# Altium schematic sheet [6]H-bridge2.SchDoc
size Tabloid
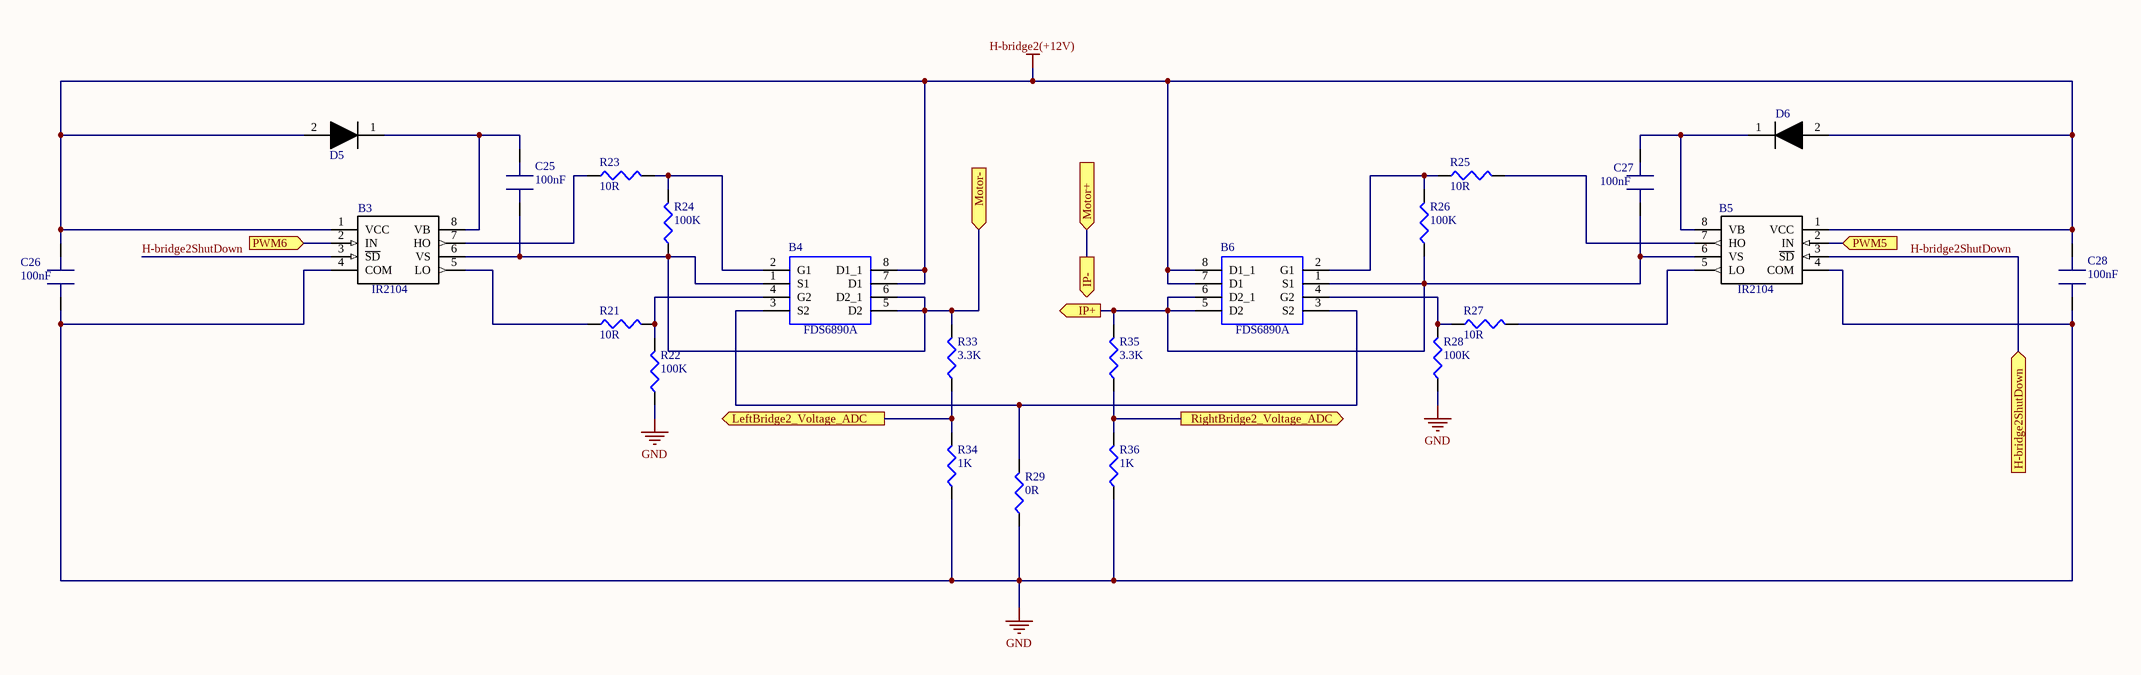
[diagram p0: [6]H-bridge2.SchDoc]

## Parts
B3  IR2104  [*SOIC127P600X175-8N]
B4  FDS6890A  [SOIC127P600X175-8N]
B5  IR2104  [*SOIC127P600X175-8N]
B6  FDS6890A  [SOIC127P600X175-8N]
C25  100nF  [cap_805]
C26  100nF  [cap_805]
C27  100nF  [cap_805]
C28  100nF  [cap_805]
D5  Doide_SS34  [Doide_SS34]  (value not drawn)
D6  Doide_SS34  [Doide_SS34]  (value not drawn)
R21  10R  [Res805]
R22  100K  [Res805]
R23  10R  [Res805]
R24  100K  [Res805]
R25  10R  [Res805]
R26  100K  [Res805]
R27  10R  [Res805]
R28  100K  [Res805]
R29  0R  [Res805]
R33  3.3K  [Res805]
R34  1K  [Res805]
R35  3.3K  [Res805]
R36  1K  [Res805]

## Ports
H-bridge2ShutDown (in), IP+, IP- (out), LeftBridge2_Voltage_ADC (out), Motor+ (in), Motor-, PWM5 (in), PWM6 (in), RightBridge2_Voltage_ADC (out)

## Nets
GND: B3.4(COM) B5.4(COM) C26.1 C28.1 R22.1 R28.1 R29.1 R34.1 R36.1
H-bridge2(+12V): B3.1(VCC) B4.7(D1) B4.8(D1_1) B5.1(VCC) B6.7(D1) B6.8(D1_1) C26.2 C28.2 D5.2 D6.2
H-bridge2ShutDown: B3.3(~{SD}) B5.3(~{SD}) ; port H-bridge2ShutDown
IP+: B5.6(VS) B6.1(S1) B6.5(D2) B6.6(D2_1) C27.1 R26.1 R35.2 ; port IP+
IP-: port IP-, port Motor+
LeftBridge2_Voltage_ADC: R33.1 R34.2 ; port LeftBridge2_Voltage_ADC
Motor-: B3.6(VS) B4.1(S1) B4.5(D2) B4.6(D2_1) C25.1 R24.1 R33.2 ; port Motor-
PWM5: B5.2(IN) ; port PWM5
PWM6: B3.2(IN) ; port PWM6
RightBridge2_Voltage_ADC: R35.1 R36.2 ; port RightBridge2_Voltage_ADC
NetB3_5: B3.5(LO) R21.1
NetB3_7: B3.7(HO) R23.1
NetB3_8: B3.8(VB) C25.2 D5.1
NetB4_2: B4.2(G1) R23.2 R24.2
NetB4_3: B4.3(S2) B6.3(S2) R29.2
NetB4_4: B4.4(G2) R21.2 R22.2
NetB5_5: B5.5(LO) R27.2
NetB5_7: B5.7(HO) R25.2
NetB5_8: B5.8(VB) C27.2 D6.1
NetB6_2: B6.2(G1) R25.1 R26.2
NetB6_4: B6.4(G2) R27.1 R28.2

## Library data of the parts
B3 B5 = IR2104STRPBF: Half Bridge Driver, Single Input Plus Inverting Shutdown Pin, Fixed 520ns Deadtime in a 8-Lead package; MF: Infineon Technologies; MP: IR2104STRPBF; SnapEDA_Link: https://www.snapeda.com/parts/IR2104STRPBF/Infineon%20Technologies/view-part/?ref=snap; Package: SOIC-8 Infineon; Digi-Key_Part_Number: IR2104SPBFCT-ND; Digi-Key_Purchase_URL: https://www.digikey.com/product-detail/en/infineon-technologies/IR2104STRPBF/IR2104SPBFCT-ND/812609?utm_source=snapeda&utm_medium=aggregator&utm_campaign=symbol; Value: *
B4 B6 = FDS6890A: FDS6890A, Dual N-channel MOSFET Transistor 7.5 A 20 V, 8-Pin SOIC; Manufacturer_Name: Fairchild Semiconductor; Geometry.Height: 1.75mm; Manufacturer_Part_Number: FDS6890A; RS Part Number: 6710633P; RS Price/Stock: http://uk.rs-online.com/web/p/products/6710633P; Mouser Part Number: 512-FDS6890A; Mouser Price/Stock: https://www.mouser.com/Search/Refine.aspx?Keyword=512-FDS6890A; Datasheet Link: http://docs-emea.rs-online.com/webdocs/0d23/0900766b80d235c9.pdf
C25-C28 = cap805
R21-R29 R33-R36 = Res805